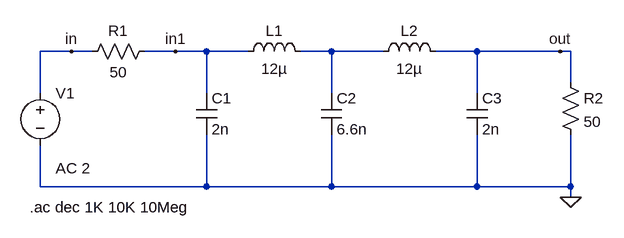
[diagram p0: schematic lp5_phase.asc]
lp5_phase.asc, the LTspice schematic file:
Version 4
SHEET 1 936 680
WIRE 112 64 64 64
WIRE 144 64 112 64
WIRE 272 64 224 64
WIRE 320 64 272 64
WIRE 384 64 320 64
WIRE 512 64 464 64
WIRE 592 64 512 64
WIRE 736 64 672 64
WIRE 864 64 736 64
WIRE 880 64 864 64
WIRE 880 112 880 64
WIRE 64 128 64 64
WIRE 320 128 320 64
WIRE 512 128 512 64
WIRE 736 128 736 64
WIRE 64 272 64 208
WIRE 320 272 320 192
WIRE 320 272 64 272
WIRE 512 272 512 192
WIRE 512 272 320 272
WIRE 736 272 736 192
WIRE 736 272 512 272
WIRE 880 272 880 192
WIRE 880 272 736 272
WIRE 880 288 880 272
FLAG 880 288 0
FLAG 864 64 out
FLAG 112 64 in
FLAG 272 64 in1
SYMBOL res 240 48 R90
WINDOW 0 0 56 VBottom 2
WINDOW 3 32 56 VTop 2
SYMATTR InstName R1
SYMATTR Value 50
SYMBOL voltage 64 112 R0
WINDOW 123 24 132 Left 2
WINDOW 39 0 0 Left 2
SYMATTR Value2 AC 2
SYMATTR InstName V1
SYMATTR Value ""
SYMBOL ind 368 80 R270
WINDOW 0 32 56 VTop 2
WINDOW 3 5 56 VBottom 2
SYMATTR InstName L1
SYMATTR Value 12µ
SYMBOL cap 304 128 R0
SYMATTR InstName C1
SYMATTR Value 2n
SYMBOL cap 496 128 R0
SYMATTR InstName C2
SYMATTR Value 6.6n
SYMBOL ind 576 80 R270
WINDOW 0 32 56 VTop 2
WINDOW 3 5 56 VBottom 2
SYMATTR InstName L2
SYMATTR Value 12µ
SYMBOL cap 720 128 R0
SYMATTR InstName C3
SYMATTR Value 2n
SYMBOL res 864 96 R0
SYMATTR InstName R2
SYMATTR Value 50
TEXT 48 304 Left 2 !.ac dec 1K 10K 10Meg

The netlist it stands for:
* lp5_phase.asc
R1 in1 in 50
V1 in 0 AC 2
L1 in1 N001 12µ
C1 in1 0 2n
C2 N001 0 6.6n
L2 N001 out 12µ
C3 out 0 2n
R2 out 0 50
.ac dec 1K 10K 10Meg
.backanno
.end